# Altium schematic sheet V1.0.SchDoc
size 63 x 35 mm; PageSetup: Record=PageOptions|CenterHorizontal=True|CenterVertical=True|PrintScale=0.71|XCorrection=1.00|YCorrection=1.00|PrintKind=1|BorderSize=5000000|LeftOffset=0|BottomOffset=0|Orientation=2|PaperLength=1000|PaperWidth=1000|Scale=100|PaperSource=15|PrintQuality=4000|MediaType=1|DitherType=10|PrintScaleMode=1|PaperKind=A4|PaperIndex=9
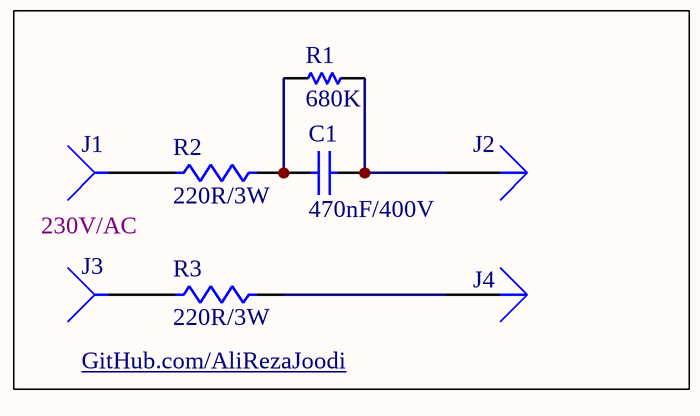
[diagram p0: V1.0.SchDoc]

## Parts
C1  470nF/400V  [C_THD_CER_(P5.08-D8-T3)]
J1  1PIN  (value not drawn)
J2  1PIN  (value not drawn)
J3  1PIN  (value not drawn)
J4  1PIN  (value not drawn)
R1  680K  [R_THD_AXIAL0.4(1/4W)]
R2  220R/3W  [R_THD_AXIAL0.9(3W)]
R3  220R/3W  [R_THD_AXIAL0.9(3W)]

## Nets
NetC1_1: C1.1 R1.1 R2.2
NetC1_2: C1.2 J2.1(A) R1.2
NetJ1_1: J1.1(A) R2.1
NetJ3_1: J3.1(A) R3.1
NetJ4_1: J4.1(A) R3.2

## Notes on the sheet
- 230V/AC
- GitHub.com/AliRezaJoodi

## Library data of the parts
C1 = Capacitor_Ceramic: Capacitor, Ceramic Multilayer; Revision: July-2002: Re-released for DXP Platform.
J1 J3 = Connector_Socket_1Pin_Female: Connector, Socket, 1Pin; Revision: July-2002: Re-released for DXP Platform.
J2 J4 = Connector_Socket_1Pin_Male: Connector, Socket, 1Pin; Revision: July-2002: Re-released for DXP Platform.
R1 = Resistor: Revision: July-2002: Re-released for DXP Platform.
R2 R3 = Resistor_2Form: Resistor; Revision: July-2002: Re-released for DXP Platform.